# Altium schematic sheet MCU_G0.SchDoc
size A1
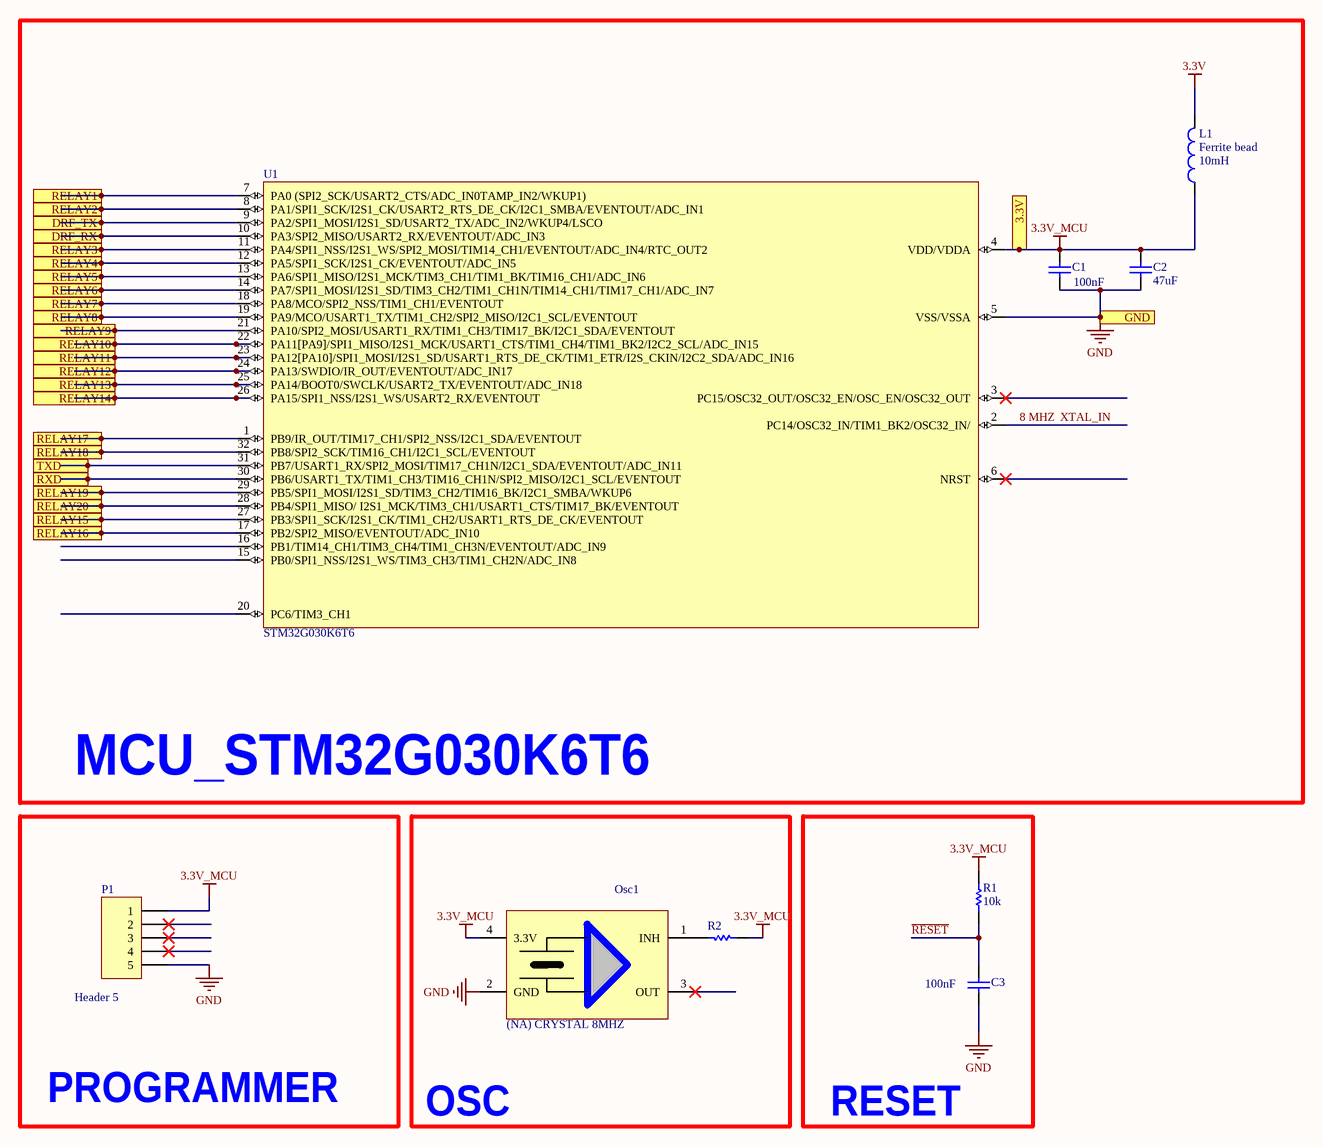
[diagram p0: MCU_G0.SchDoc]

## Parts
C1  100nF  [0603 - RESISTOR]
C2  47uF  [0603 - RESISTOR]
C3  100nF  [0603 - RESISTOR]
L1  Ferrite bead  value 10mH  [0603 - RESISTOR]
Osc1  (NA) CRYSTAL 8MHZ  [XTAL_5X7]
P1  Header 5  [HDR1X5_2mm_small]
R1  10k  [0603 - RESISTOR]
R2  (NA)10k  [0603 - RESISTOR]  (value not drawn)
U1  STM32G030K6T6  [LQFP32]

## Blocks framed on the sheet
MCU_STM32G030K6T6: C1 C2 L1 U1
PROGRAMMER: P1
OSC: Osc1 R2
RESET: C3 R1

## Ports
3.3V, DRF_RX, DRF_TX, GND, RELAY1, RELAY2, RELAY3, RELAY4, RELAY5, RELAY6, RELAY7, RELAY8, RELAY9, RELAY10, RELAY11, RELAY12, RELAY13, RELAY14, RELAY15, RELAY16, RELAY17, RELAY18, RELAY19, RELAY20, RXD, TXD

## Nets
3.3V: L1.2
3.3V_MCU: C1.2 C2.2 L1.1 Osc1.4(3.3V) P1.1 R1.2 R2.1 U1.4(VDD/VDDA) ; port 3.3V
GND: C1.1 C2.1 C3.1 Osc1.2(GND) P1.5 U1.5(VSS/VSSA) ; port GND
8 MHZ: U1.2(PC14/OSC32_IN/TIM1_BK2/OSC32_IN/)  [also labelled XTAL_IN]
DRF_RX: U1.10(PA3/SPI2_MISO/USART2_RX/EVENTOUT/ADC_IN3) ; port DRF_RX
DRF_TX: U1.9(PA2/SPI1_MOSI/I2S1_SD/USART2_TX/ADC_IN2/WKUP4/LSCO) ; port DRF_TX
~{RESET}: C3.2 R1.1
RELAY1: U1.7(PA0_(SPI2_SCK/USART2_CTS/ADC_IN0TAMP_IN2/WKUP1)) ; port RELAY1
RELAY2: U1.8(PA1/SPI1_SCK/I2S1_CK/USART2_RTS_DE_CK/I2C1_SMBA/EVENTOUT/ADC_IN1) ; port RELAY2
RELAY3: U1.11(PA4/SPI1_NSS/I2S1_WS/SPI2_MOSI/TIM14_CH1/EVENTOUT/ADC_IN4/RTC_OUT2) ; port RELAY3
RELAY4: U1.12(PA5/SPI1_SCK/I2S1_CK/EVENTOUT/ADC_IN5) ; port RELAY4
RELAY5: U1.13(PA6/SPI1_MISO/I2S1_MCK/TIM3_CH1/TIM1_BK/TIM16_CH1/ADC_IN6) ; port RELAY5
RELAY6: U1.14(PA7/SPI1_MOSI/I2S1_SD/TIM3_CH2/TIM1_CH1N/TIM14_CH1/TIM17_CH1/ADC_IN7) ; port RELAY6
RELAY7: U1.18(PA8/MCO/SPI2_NSS/TIM1_CH1/EVENTOUT) ; port RELAY7
RELAY8: U1.19(PA9/MCO/USART1_TX/TIM1_CH2/SPI2_MISO/I2C1_SCL/EVENTOUT) ; port RELAY8
RELAY9: U1.21(PA10/SPI2_MOSI/USART1_RX/TIM1_CH3/TIM17_BK/I2C1_SDA/EVENTOUT) ; port RELAY9
RELAY10: U1.22(PA11[PA9]/SPI1_MISO/I2S1_MCK/USART1_CTS/TIM1_CH4/TIM1_BK2/I2C2_SCL/ADC_IN15) ; port RELAY10
RELAY11: U1.23(PA12[PA10]/SPI1_MOSI/I2S1_SD/USART1_RTS_DE_CK/TIM1_ETR/I2S_CKIN/I2C2_SDA/ADC_IN16) ; port RELAY11
RELAY12: U1.24(PA13/SWDIO/IR_OUT/EVENTOUT/ADC_IN17) ; port RELAY12
RELAY13: U1.25(PA14/BOOT0/SWCLK/USART2_TX/EVENTOUT/ADC_IN18) ; port RELAY13
RELAY14: U1.26(PA15/SPI1_NSS/I2S1_WS/USART2_RX/EVENTOUT) ; port RELAY14
RELAY15: U1.27(PB3/SPI1_SCK/I2S1_CK/TIM1_CH2/USART1_RTS_DE_CK/EVENTOUT) ; port RELAY15
RELAY16: U1.17(PB2/SPI2_MISO/EVENTOUT/ADC_IN10) ; port RELAY16
RELAY17: U1.1(PB9/IR_OUT/TIM17_CH1/SPI2_NSS/I2C1_SDA/EVENTOUT) ; port RELAY17
RELAY18: U1.32(PB8/SPI2_SCK/TIM16_CH1/I2C1_SCL/EVENTOUT) ; port RELAY18
RELAY19: U1.29(PB5/SPI1_MOSI/I2S1_SD/TIM3_CH2/TIM16_BK/I2C1_SMBA/WKUP6) ; port RELAY19
RELAY20: U1.28(PB4/SPI1_MISO/_I2S1_MCK/TIM3_CH1/USART1_CTS/TIM17_BK/EVENTOUT) ; port RELAY20
RXD: U1.30(PB6/USART1_TX/TIM1_CH3/TIM16_CH1N/SPI2_MISO/I2C1_SCL/EVENTOUT) ; port RXD
TXD: U1.31(PB7/USART1_RX/SPI2_MOSI/TIM17_CH1N/I2C1_SDA/EVENTOUT/ADC_IN11) ; port TXD
NetOsc1_1: Osc1.1(INH) R2.2

Not connected (* = marked no-connect by the designer): Osc1 3(OUT)*; P1 2* 3* 4*; U1 3(PC15/OSC32_OUT/OSC32_EN/OSC_EN/OSC32_OUT)* 6(NRST)* 15(PB0/SPI1_NSS/I2S1_WS/TIM3_CH3/TIM1_CH2N/ADC_IN8) 16(PB1/TIM14_CH1/TIM3_CH4/TIM1_CH3N/EVENTOUT/ADC_IN9) 20(PC6/TIM3_CH1)

## Library data of the parts
C1-C3 = Cap: Capacitor; Published: 8-Jun-2000; LatestRevisionDate: 17-Jul-2002; LatestRevisionNote: Re-released for DXP Platform.; PackageReference: RAD-0.3; Publisher: Altium Limited; PackageDescription: Radial Cap, Thru-Hole; 2 Leads; 0.3 in Pin Spacing
  C1 C3: Value: 100nF
  C2: Value: 47uF
L1 = Inductor: Code_IEC: 1005; Published: 8-Jun-2000; LatestRevisionDate: 29-May-2009; LatestRevisionNote: IPC-7351 Footprint Added.; PackageReference: 0402-A; Publisher: Altium Limited; PackageDescription: Chip Inductor; Code_JEITA: 0402
Osc1 = OSILATOR
P1 = Header 5: Header, 5-Pin; LatestRevisionDate: 17-Jul-2002; LatestRevisionNote: Re-released for DXP Platform.; Publisher: Altium Limited
R1 R2 = Res1: Resistor; Published: 8-Jun-2000; LatestRevisionDate: 17-Jul-2002; LatestRevisionNote: Re-released for DXP Platform.; PackageReference: AXIAL-0.3; Publisher: Altium Limited; PackageDescription: Axial Device, Thru-Hole; 2 Leads; 0.3 in Pin Spacing
  R1: Value: 10k
  R2: Value: (NA)10k
U1 = STM32G030K6T6: ARMÂ® CortexÂ®-M0+ STM32G0 Microcontroller IC 32-Bit 64MHz 32KB (32K x 8) FLASH 32-LQFP (7x7); MF: STMicroelectronics; Purchase-URL: https://pricing.snapeda.com/search/part/STM32G030K6T6/?ref=eda; Check_prices: https://www.snapeda.com/parts/STM32G030K6T6/STMicroelectronics/view-part/4001295/?ref=eda; Value: *; MP: STM32G030K6T6; SnapEDA_Link: https://www.snapeda.com/parts/STM32G030K6T6/STMicroelectronics/view-part/4001295/?ref=snap; Availability: In Stock; Price: None; Package: LQFP-32 STMicroelectronics